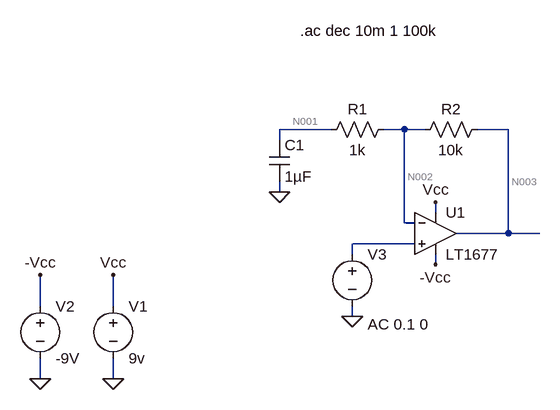
[diagram p0: schematic Draft3.asc]
Draft3.asc, the LTspice schematic file:
Version 4
SHEET 1 880 680
WIRE -96 160 -176 160
WIRE 16 160 -16 160
WIRE 48 160 16 160
WIRE 176 160 128 160
WIRE -176 176 -176 160
WIRE -176 256 -176 240
WIRE 64 288 64 272
WIRE 16 304 16 160
WIRE 32 304 16 304
WIRE 176 320 176 160
WIRE 176 320 96 320
WIRE 224 320 176 320
WIRE 32 336 -64 336
WIRE -64 352 -64 336
WIRE 64 368 64 352
WIRE -544 432 -544 384
WIRE -432 432 -432 384
WIRE -64 448 -64 432
WIRE -544 544 -544 512
WIRE -432 544 -432 512
FLAG -176 256 0
FLAG 64 272 Vcc
FLAG 64 368 -Vcc
FLAG -432 384 Vcc
FLAG -432 544 0
FLAG -544 384 -Vcc
FLAG -544 544 0
FLAG -64 448 0
SYMBOL res 0 144 R90
WINDOW 0 0 56 VBottom 2
WINDOW 3 32 56 VTop 2
SYMATTR InstName R1
SYMATTR Value 1k
SYMBOL res 144 144 R90
WINDOW 0 0 56 VBottom 2
WINDOW 3 32 56 VTop 2
SYMATTR InstName R2
SYMATTR Value 10k
SYMBOL cap -192 176 R0
SYMATTR InstName C1
SYMATTR Value 1µF
SYMBOL Opamps\\LT1677 64 256 R0
SYMATTR InstName U1
SYMBOL voltage -432 416 R0
WINDOW 123 0 0 Left 2
WINDOW 39 0 0 Left 2
SYMATTR InstName V1
SYMATTR Value 9v
SYMBOL voltage -544 416 R0
WINDOW 123 0 0 Left 2
WINDOW 39 0 0 Left 2
SYMATTR InstName V2
SYMATTR Value -9V
SYMBOL voltage -64 336 R0
WINDOW 123 24 124 Left 2
WINDOW 39 0 0 Left 2
SYMATTR InstName V3
SYMATTR Value ""
SYMATTR Value2 AC 0.1 0
TEXT -144 8 Left 2 !.ac dec 10m 1 100k

The netlist it stands for:
* Draft3.asc
R1 N002 N001 1k
R2 N003 N002 10k
C1 N001 0 1µF
XU1 N004 N002 Vcc -Vcc N003 LT1677  ; pins In+ In- V+ V- OUT
V1 Vcc 0 9v
V2 -Vcc 0 -9V
V3 N004 0 AC 0.1 0
.ac dec 10m 1 100k
.lib LTC.lib
.backanno
.end

* Results of the author's LTspice run, read from the files saved beside the schematic
* Operating Point, zero values left out:
*   V(n002) = -328.6 nV
*   V(n001) = -328.6 nV
*   V(n003) = 332.1 nV
*   V(vcc) = 9 V
*   V(-vcc) = -9 V
*   I(R2) = 66.07 pA
*   I(V3) = -66.07 pA
*   I(V2) = 2.578 mA
*   I(V1) = -2.578 mA
*   Ix(u1:1) = 66.07 pA
*   Ix(u1:2) = 66.07 pA
*   Ix(u1:3) = 2.578 mA
*   Ix(u1:4) = -2.578 mA
*   Ix(u1:5) = -66.06 pA
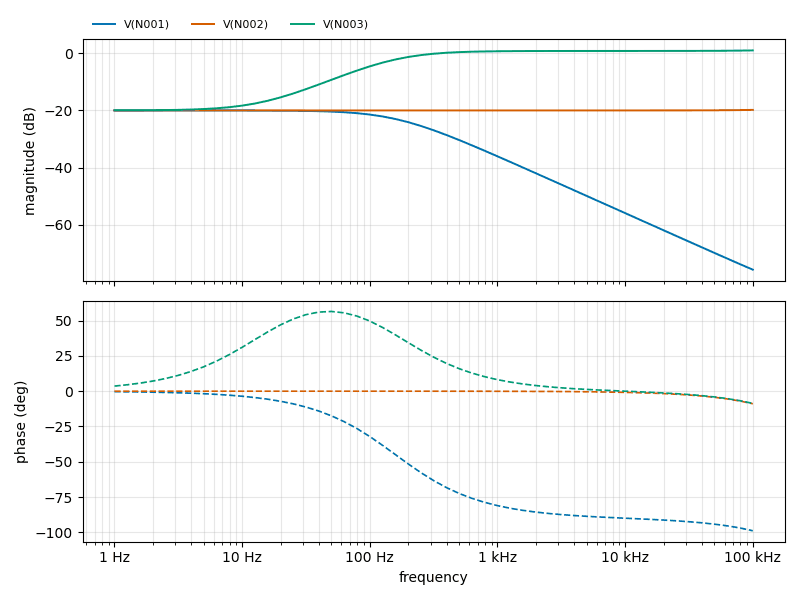
[diagram p1: AC Analysis of Draft3.asc, plotted from the saved traces]
* AC Analysis, 1 run:
*   V(N001): -20.00 dB at 1 Hz, -75.77 dB at 100 kHz, peak -20.00 dB at 1 Hz, 3 dB below the peak at 159.1 Hz
*   V(N002): -20.00 dB at 1 Hz, -19.81 dB at 100 kHz, peak -19.81 dB at 100 kHz
*   V(N003): -19.98 dB at 1 Hz, 1.02 dB at 100 kHz, peak 1.02 dB at 100 kHz, 3 dB below the peak at 165.8 Hz